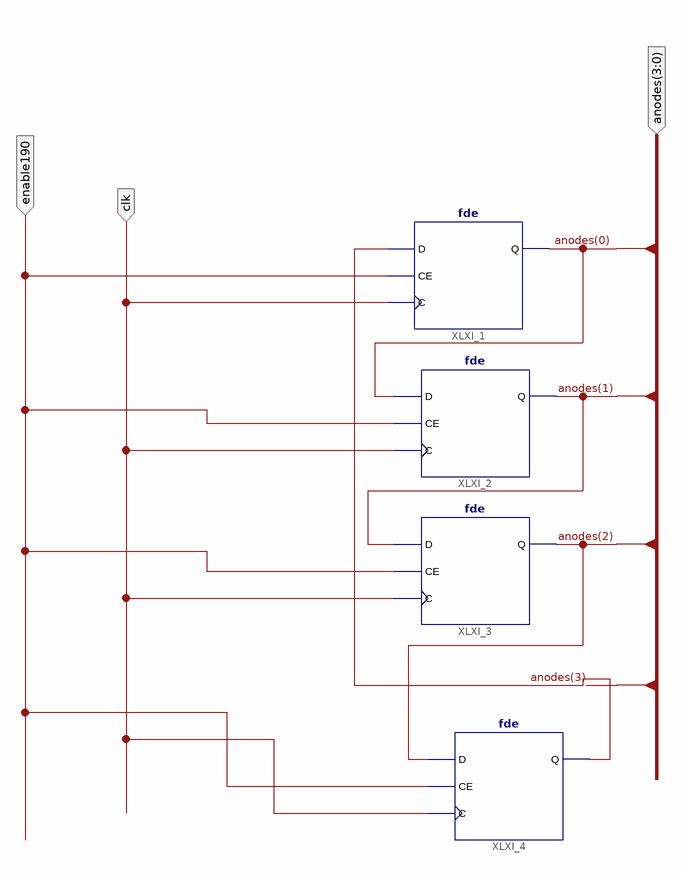
[diagram p0: schematic sheet 1]
// Xilinx ISE schematic shiftanodes.sch (spartan6) as structural Verilog: 4 symbols, 3 ports
module shiftanodes (
  input  clk,
  input  enable190,
  input  [3:0] anodes
);

  wire XLXN_6;

  fde XLXI_1 (.C(clk), .CE(enable190), .D(XLXN_6), .Q(anodes[0]));
  fde XLXI_2 (.C(clk), .CE(enable190), .D(anodes[0]), .Q(anodes[1]));
  fde XLXI_3 (.C(clk), .CE(enable190), .D(anodes[1]), .Q(anodes[2]));
  fde XLXI_4 (.C(clk), .CE(enable190), .D(anodes[2]), .Q(XLXN_6));
endmodule
